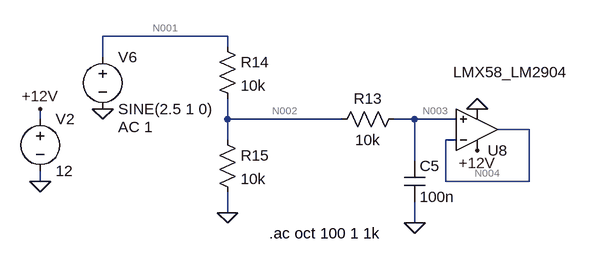
[diagram p0: schematic 低通滤波器.asc]
* 低通滤波器.asc
V2 +12V 0 12
* U8: LMX58_LM2904 (symbol model\LMX58_LM2904 not available, pins judged from their places): In+=N003 In-=N004 V+=+12V V-=0 OUT=N004
R13 N003 N002 10k
C5 N003 0 100n
R14 N001 N002 10k
R15 N002 0 10k
V6 N001 0 SINE(2.5 1 0) AC 1
.ac oct 100 1 1k
.backanno
.end

* Results of the author's LTspice run, read from the files saved beside the schematic
* Operating Point, zero values left out:
*   V(n003) = 1.25 V
*   V(n002) = 1.25 V
*   V(n001) = 2.5 V
*   V(+12v) = 12 V
*   V(n004) = 1.252 V
*   I(R13) = 20 nA
*   I(R15) = 125 µA
*   I(V2) = -350 µA
*   I(R14) = 125 µA
*   I(V6) = -125 µA
*   Ix(u8:in+) = -20 nA
*   Ix(u8:in-) = -18 nA
*   Ix(u8:vcc) = 350 µA
*   Ix(u8:vee) = -350 µA
*   Ix(u8:out) = 18 nA
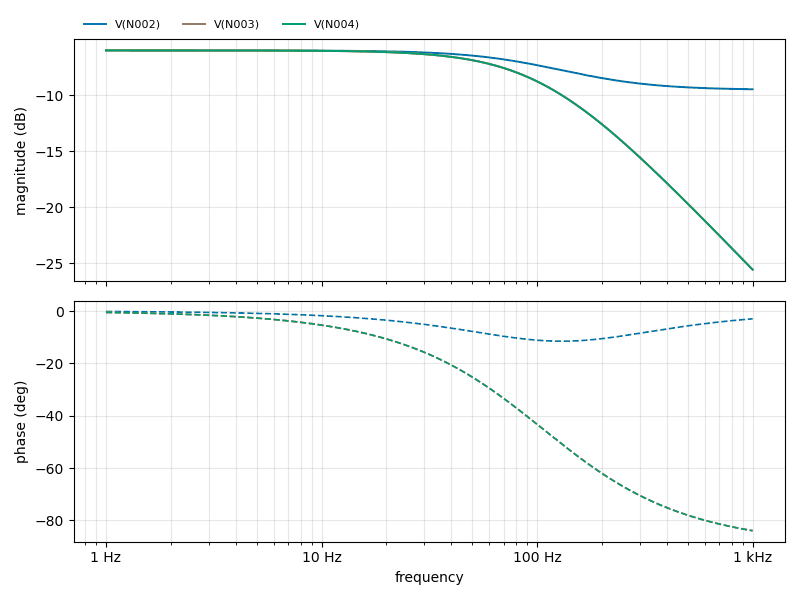
[diagram p1: AC Analysis of 低通滤波器.asc, plotted from the saved traces]
* AC Analysis, 1 run:
*   V(N002): -6.02 dB at 1 Hz, -9.48 dB at 1 kHz, peak -6.02 dB at 1 Hz, 3 dB below the peak at 318.4 Hz
*   V(N003): -6.02 dB at 1 Hz, -25.55 dB at 1 kHz, peak -6.02 dB at 1 Hz, 3 dB below the peak at 106.1 Hz
*   V(N004): -6.02 dB at 1 Hz, -25.55 dB at 1 kHz, peak -6.02 dB at 1 Hz, 3 dB below the peak at 106.1 Hz